# EAGLE design Clock_fab (EAGLE 8.2.1)
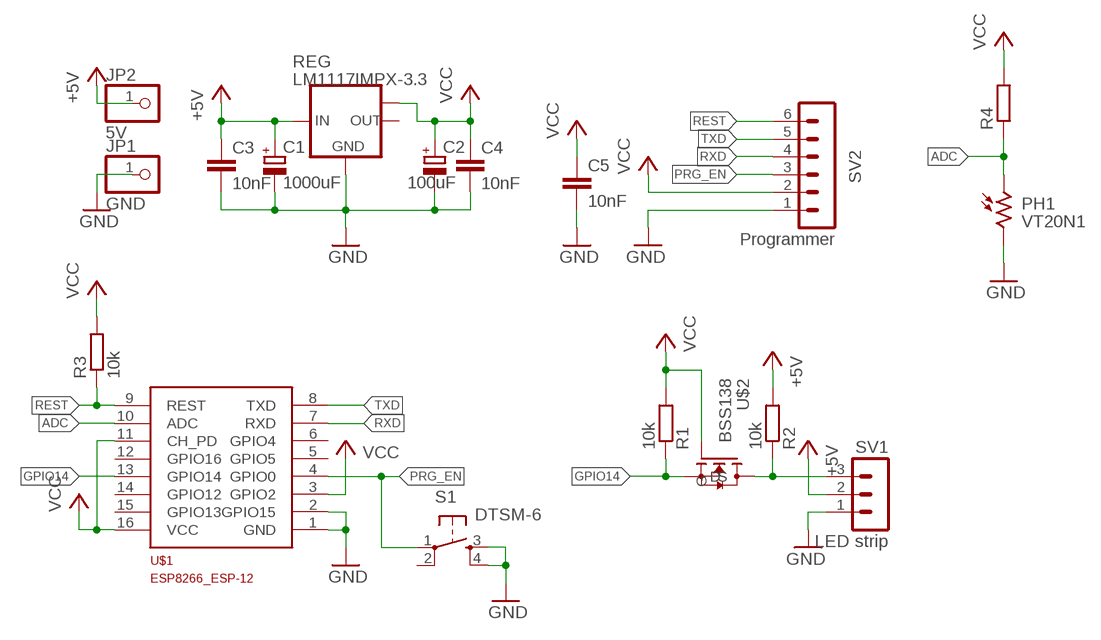
[diagram p0: schematic, sheet 1]

## Parts
C1  1000uF  CPOL-EUTT5D11L  [TT5D11L]
C2  100uF  CPOL-EUTT5D7L  [TT5D7L]
C3  10nF  C-EUC0805  [C0805]
C4  10nF  C-EUC0805  [C0805]
C5  10nF  C-EUC0805  [C0805]
JP1  GND  PINHD-1X1  [1X01]
JP2  5V  PINHD-1X1  [1X01]
PH1  VT20N1  [TO46-VT200]
R1  10k  R-EU_R0805  [R0805]
R2  10k  R-EU_R0805  [R0805]
R3  10k  R-EU_R0805  [R0805]
R4  R-EU_R0805  [R0805]
REG  LM1117IMPX-3.3  [SOT223]
S1  DTSM-6  [DTSM-6]
SV1  LED strip  MA03-1  [MA03-1]
SV2  Programmer  MA06-1  [MA06-1]
U$1  ESP8266_ESP-12  [ESP8266-ESP12]
U$2  BSS138  [BSS138]

## Nets
+5V: C1.+ C3.1 JP2.1 R2.2 REG.3(IN) SV1.2
ADC: PH1.1 R4.1 U$1.10(ADC)
GND: C1.- C2.- C3.2 C4.2 C5.2 JP1.1 PH1.2 REG.1(GND) S1.3 S1.4 SV1.1 SV2.1 U$1.1(GND) U$1.2(GPIO15)
GPIO14: R1.1 U$1.13(GPIO14) U$2.S
N$7: R2.1 SV1.3 U$2.D
PRG_EN: S1.1 SV2.3 U$1.4(GPIO0)
REST: R3.1 SV2.6 U$1.9(REST)
RXD: SV2.4 U$1.7(RXD)
TXD: SV2.5 U$1.8(TXD)
VCC: C2.+ C4.1 C5.1 R1.2 R3.2 R4.2 REG.TAB(OUT1) SV2.2 U$1.3(GPIO2) U$1.11(CH_PD) U$1.16(VCC) U$2.G
Unconnected: REG.2(OUT) S1.2 U$1.5(GPIO5) U$1.6(GPIO4) U$1.12(GPIO16) U$1.14(GPIO12) U$1.15(GPIO13)

## Library data of the parts
C1 C2 = rcl:CPOL-EU: POLARIZED CAPACITOR, European symbol
C3-C5 = rcl:C-EU: CAPACITOR, European symbol
JP1 JP2 = pinhead:PINHD-1X1: PIN HEADER
PH1 = photo-elements:VT2*: Photoconductive Cell VT200 Series Source: http://optoelectronics.perkinelmer.com/content/Datasheets/DTS_vt200seriesdatasheet.pdf
R1-R4 = rcl:R-EU_: RESISTOR, European symbol
REG = lm1117:LM1117IMPX-*
S1 = switch-tact:DTSM-6
SV1 = con-lstb:MA03-1: PIN HEADER; OC_FARNELL: unknown; OC_NEWARK: unknown
SV2 = con-lstb:MA06-1: PIN HEADER; OC_FARNELL: unknown; OC_NEWARK: unknown
U$1 = ESP8266-ESP12:ESP8266_ESP-12
U$2 = BSS138:BSS138: BSS138 N-Channel Logic Level Enhancement Mode Field Effect Transistor; AVAILABILITY: Good; DESCRIPTION: B138 Series 50 V 6 Ohms N-Ch Logic Level Enhancement Mode FET - SOT-23-3; MF: Fairchild Semiconductor; MP: BSS138; PACKAGE: SOT-23-3 Fairchild Semiconductor; PRICE: 18.54 USD

## Board
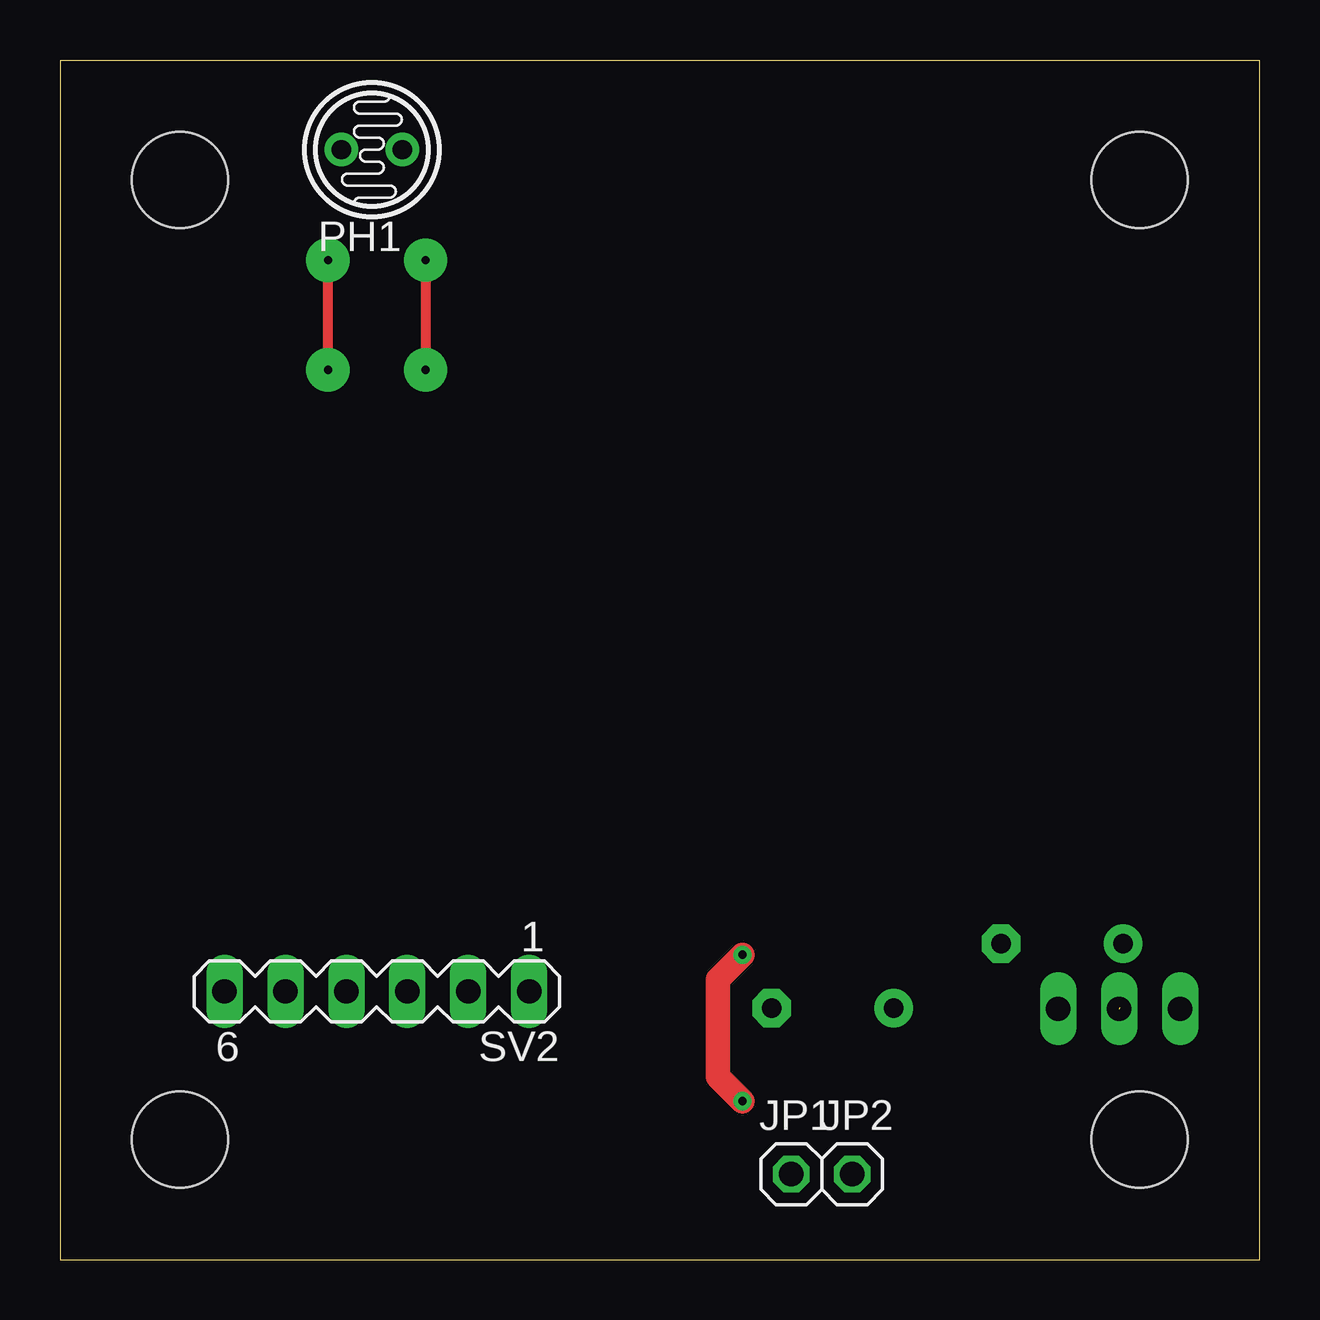
[diagram p1: board, top side]
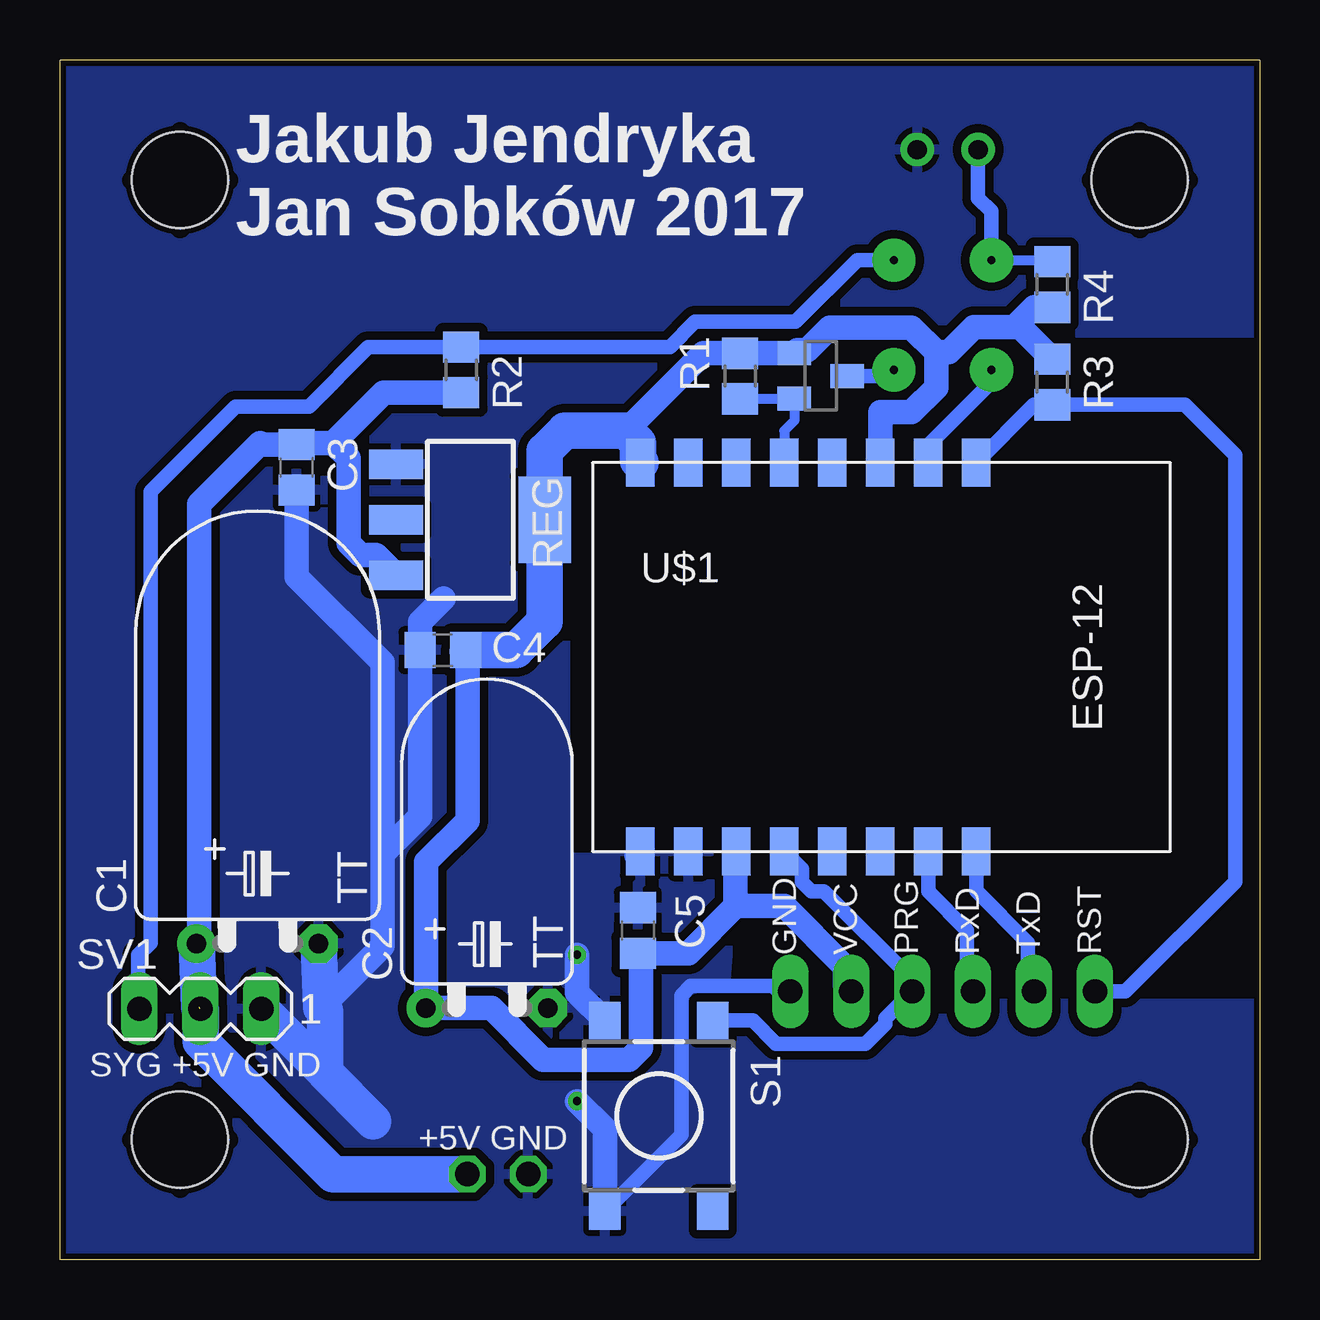
[diagram p2: board, bottom side, seen from below]

Size 50 x 50 mm. Coordinates in mm from the lower left corner, seen from the top.
Outline: 0,0 50,0 50,50 0,50 0,0
Copper layers (1*16): Top 0.035mm / dielectric 1.5mm / Bottom 0.035mm
Design rules "default *": minimum track width 6mil, minimum drill 0.35mm, track to track 14mil, track to pad 14mil, pad to pad 14mil, via to via 14mil, smd to smd 6mil, copper to edge 10mil, drill to drill 10mil, minimum pad ring 10mil, minimum via ring 8mil, stop-mask expansion 4mil, vias tented up to drill 0mil, thermal gap 10mil
Holes 4 mm at 45,45 5,45 5,5 45,5

### Footprints (pad centres in the part's own frame; a part is rotated, then mirrored left to right if it is on the bottom)
TT5D11L = drill 0.813 pad 1.6: + -2.54,0 | drill 0.813 pad 1.6 octagon: - 2.54,0
TT5D7L = drill 0.813 pad 1.6: + -2.54,0 | drill 0.813 pad 1.6 octagon: - 2.54,0
C0805 = smd 1.3 x 1.5: 1 -0.95,0; 2 0.95,0
1X01 = drill 1.016 octagon: 1 0,0
TO46-VT200 = drill 0.8 pad 1.4: 1 -1.27,0; 2 1.27,0
R0805 = smd 1.3 x 1.5: 1 -0.95,0; 2 0.95,0
SOT223 = smd 1.219 x 2.235: 1 -2.311,-3.099; 2 0,-3.099; 3 2.311,-3.099 | smd 3.6 x 2.2: TAB 0,3.099
DTSM-6 = smd 1.55 x 1.3: 1 -3.975,2.25; 2 3.975,2.25; 3 -3.975,-2.25; 4 3.975,-2.25
MA03-1 = drill 1.016 long: 1 -2.54,0; 2 0,0; 3 2.54,0
MA06-1 = drill 1.016 long: 1 -6.35,0; 2 -3.81,0; 3 -1.27,0; 4 1.27,0; 5 3.81,0; 6 6.35,0
ESP8266-ESP12 = smd 2 x 1.2: 1 16.2,2; 2 16.2,4; 3 16.2,6; 4 16.2,8; 5 16.2,10; 6 16.2,12; 7 16.2,14; 8 16.2,16; 9 0,16; 10 0,14; 11 0,12; 12 0,10; 13 0,8; 14 0,6; 15 0,4; 16 0,2
BSS138 = smd 1 x 1.4: D 0,1.1; G -0.95,-1.1; S 0.95,-1.1

### Placement (x,y rotation side)
C1  41.77,13.17 0 bottom
C2  32.2,10.48 0 bottom
C3  40.13,33.02 270 bottom
C4  34.04,25.4 180 bottom
C5  25.91,13.72 90 bottom
JP1  30.48,3.56 0 top
JP2  33.02,3.56 0 top
PH1  13,46.26 0 top
R1  21.65,36.82 90 bottom
R2  33.27,37.08 270 bottom
R3  8.64,36.58 90 bottom
R4  8.64,40.64 270 bottom
REG  32.89,30.84 270 bottom
S1  25.04,5.99 270 bottom
SV1  44.15,10.45 180 bottom
SV2  13.21,11.18 180 top
U$1  27.81,33.21 270 bottom
U$2  18.29,36.83 270 bottom

### Tracks (layer width: path | path; a pad name or v marks a point on that pad's centre or on a via)
+5V  (1 unrouted)
  Bottom 0.61: SV1.2
  Bottom 1.016: REG.3 36.83,29.36 37.47,29.36 37.97,29.87 37.97,33.4 38.61,34.04 | 38.61,34.04 40.07,34.04 C3.1 | 40.2,34.04 C3.1 | R2.2 36.51,36.13 38.61,34.04 | C3.1 41.59,33.97 41.66,34.04 44.2,31.5 44.2,13.28 C1.+
  Bottom 1.524: C1.+ 44.2,10.52 | SV1.2 44.14,9.09 38.61,3.56 JP2.1
ADC  (via drill 0.35 pad 1.81)
  Top 0.406: v11.18,37.08 v11.18,41.66
  Bottom 0.406: v11.18,41.66 8.7,41.66
  Bottom 0.61: 8.7,41.66 R4.1 | v11.18,37.08 11.18,36.58 13.72,34.04 13.72,33.31 U$1.10 | PH1.1 11.73,44.24 11.18,43.69 v11.18,41.66
GND  (via drill 0.35)
  Top 1.016: v28.45,6.6 27.43,7.62 27.43,11.68 v28.45,12.7
  Bottom 0.61: SV2.1 20.05,11.18 20.28,11.4 23.71,11.4 24.1,11.01 24.1,5.2 S1.4
  Bottom 1.016: 25.97,16.85 U$1.1 | 36.56,16.9 34.99,18.47 C4.2 34.99,26.58 34.01,27.56 | 36.56,16.9 36.56,13.07 39.12,10.52 | C3.2 40.13,28.45 36.56,24.88 36.56,16.9 | S1.4 27.29,5.44 v28.45,6.6 | v28.45,12.7 28.45,11.12 S1.3
  Bottom 1.524: C1.- 39.12,10.52 38.95,10.35 38.95,7.79 | 38.95,7.79 36.95,5.76 | 38.95,7.79 SV1.1
  pour Bottom (isolate 0.254): 0,50.29 0,38.61 22.35,38.61 22.35,33.02 28.96,33.02 28.96,16.76 21.84,16.76 22.35,10.67 0,10.67 0,0 49.78,0 50.29,47.75 50.31,50.29
GPIO14
  Bottom 0.406: R1.1 U$2.S 19.39,34.97 19.81,34.54 U$1.13
  Bottom 1.016: R1.1
N$1  (via drill 0.7)
  Bottom 0.15: 47,45 v45,45 | v45,45 43,45 | v45,45 45,43 | v45,45 45,47
N$2  (via drill 0.7)
  Bottom 0.15: 7,45 v5,45 | v5,45 3,45 | v5,45 5,43 | v5,45 5,47
N$4  (via drill 0.7)
  Bottom 0.15: 7,5 v5,5 | v5,5 3,5 | v5,5 5,3 | v5,5 5,7
N$5  (via drill 0.7)
  Bottom 0.15: 47,5 v45,5 | v45,5 43,5 | v45,5 45,3 | v45,5 45,7
N$7  (via drill 0.35 pad 1.81)
  Top 0.406: v15.24,41.66 v15.24,37.08
  Bottom 0.61: U$2.D 15.49,36.83 v15.24,37.08 | 33.09,38.03 R2.1 | v15.24,41.66 15.38,41.52 15.51,41.66 16.76,41.66 19.34,39.08 23.53,39.08 24.58,38.03 R2.1 | R2.1 34.24,38.03 | SV1.3 46.74,10.5 46.74,12.7 46.23,13.21 46.23,32 42.67,35.56 39.62,35.56 37.15,38.03 R2.1
PRG_EN
  Bottom 0.61: U$1.4 19.07,16.27 19.07,15.74 18.68,15.35 18.15,15.35 14.48,11.68 SV2.3 15.6,10.06 15.6,9.82 16.43,8.99 20.15,8.99 21.12,9.96 S1.1
REST
  Bottom 0.406: U$1.9 9.56,35.47 | 9.4,35.63 9.56,35.47 | 9.56,35.47 8.8,35.47 R3.1
  Bottom 0.61: 11.94,33.34 U$1.9 | U$1.9 11.81,33.4 | R3.1 3.11,35.63 1.02,33.53 1.02,15.75 5.59,11.18 SV2.6 | U$1.9 9.4,35.63
RXD
  Bottom 0.61: U$1.7 13.81,15.33 12.19,13.72 12.19,11.43 SV2.4
TXD
  Bottom 0.61: U$1.8 11.81,15.37 9.65,13.21 9.65,11.43 SV2.5
VCC
  Bottom 1.016: 34.74,11.48 C2.+ | C2.+ 34.74,16.56 33.02,18.29 33.02,25.33 C4.1 | 26.42,34.54 23.19,37.77 R1.2 U$2.G 19.25,37.92 18.85,37.92 17.92,38.85 14.51,38.85 13.47,37.82 | 13.47,37.82 13.47,36.35 14.51,35.32 15.81,35.32 U$1.11 | 13.47,37.82 12.95,37.82 11.91,38.85 10.22,38.85 | R4.2 9.38,39.69 10.22,38.85 | 10.22,38.85 9.96,38.85 R3.2 | C2.+ 32.02,10.48 29.86,8.32 26.28,8.32 25.77,8.83 25.77,12.63 C5.1 23.81,12.77 21.84,14.73 | U$1.3 21.84,16.98 21.84,14.73 | 21.84,14.73 19.81,14.73 17.27,12.19 17.27,11.43 SV2.2
  Bottom 1.524: U$1.16 25.91,33.31 25.91,34.04 26.42,34.54 28.96,34.54 29.79,33.71 REG.TAB 29.79,26.59 30.99,25.4 32.95,25.4 33.02,25.33

### Text on the board
bPlace: Jakub Jendryka / Jan Sobków 2017 | GND / VCC / PRG / RxD / TxD / RST | SYG +5V GND | +5V GND